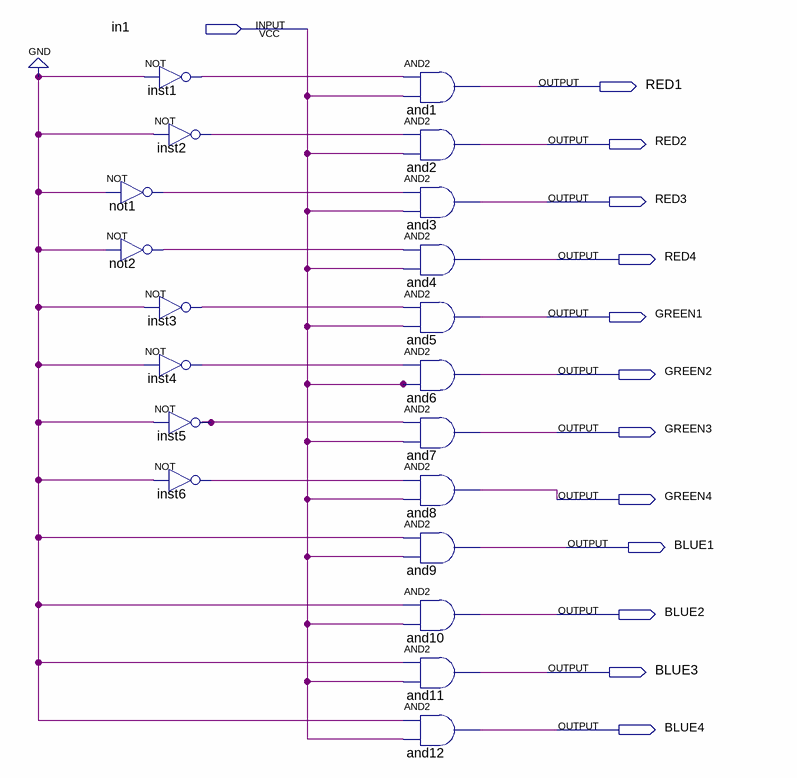
[diagram p0: schematic sheet]
// Quartus schematic yellow.bdf as structural Verilog: 20 symbols, 13 pins
module yellow (
  input  in1,
  output RED1,
  output RED2,
  output RED3,
  output RED4,
  output GREEN1,
  output GREEN2,
  output GREEN3,
  output GREEN4,
  output BLUE1,
  output BLUE2,
  output BLUE3,
  output BLUE4
);

  wire inst1_out, inst2_out, inst3_out, inst4_out, inst5_out, inst6_out, not1_out, not2_out;

  not not1 (not1_out, 1'b0);
  not not2 (not2_out, 1'b0);
  not inst1 (inst1_out, 1'b0);
  not inst2 (inst2_out, 1'b0);
  not inst3 (inst3_out, 1'b0);
  not inst4 (inst4_out, 1'b0);
  not inst5 (inst5_out, 1'b0);
  not inst6 (inst6_out, 1'b0);
  and and1 (RED1, inst1_out, in1);
  and and2 (RED2, inst2_out, in1);
  and and3 (RED3, not1_out, in1);
  and and4 (RED4, not2_out, in1);
  and and5 (GREEN1, inst3_out, in1);
  and and6 (GREEN2, inst4_out, in1);
  and and7 (GREEN3, inst5_out, in1);
  and and8 (GREEN4, inst6_out, in1);
  and and9 (BLUE1, 1'b0, in1);
  and and10 (BLUE2, 1'b0, in1);
  and and11 (BLUE3, 1'b0, in1);
  and and12 (BLUE4, 1'b0, in1);
endmodule
